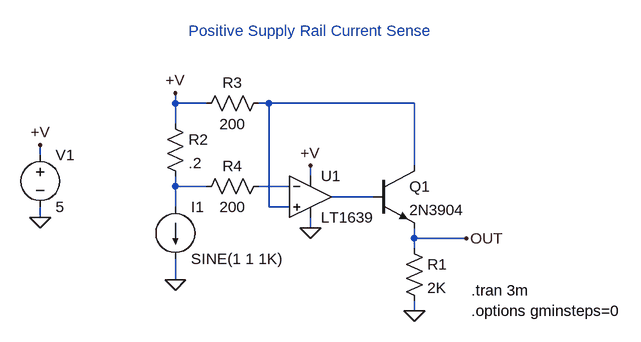
[diagram p0: schematic 1639.asc]
1639.asc, the LTspice schematic file:
Version 4
SHEET 1 896 680
WIRE -80 80 -80 64
WIRE -32 80 -80 80
WIRE 64 80 48 80
WIRE 288 80 64 80
WIRE -80 112 -80 80
WIRE -288 160 -288 144
WIRE 288 176 288 80
WIRE 128 192 128 176
WIRE -80 208 -80 192
WIRE -32 208 -80 208
WIRE 96 208 48 208
WIRE 224 224 160 224
WIRE -80 240 -80 208
WIRE 64 240 64 80
WIRE 96 240 64 240
WIRE -288 256 -288 240
WIRE 128 272 128 256
WIRE 288 288 288 272
WIRE 368 288 288 288
WIRE 288 304 288 288
WIRE -80 352 -80 320
WIRE 288 400 288 384
FLAG -288 256 0
FLAG 128 176 +V
FLAG -288 144 +V
FLAG 128 272 0
FLAG 288 400 0
FLAG -80 64 +V
FLAG -80 352 0
FLAG 368 288 OUT
SYMBOL voltage -288 144 R0
SYMATTR InstName V1
SYMATTR Value 5
SYMBOL npn 224 176 R0
SYMATTR InstName Q1
SYMATTR Value 2N3904
SYMBOL res 272 288 R0
SYMATTR InstName R1
SYMATTR Value 2K
SYMBOL res -96 96 R0
SYMATTR InstName R2
SYMATTR Value .2
SYMBOL res 64 64 R90
WINDOW 0 0 56 VBottom 2
WINDOW 3 32 56 VTop 2
SYMATTR InstName R3
SYMATTR Value 200
SYMBOL res 64 192 R90
WINDOW 0 0 56 VBottom 2
WINDOW 3 32 56 VTop 2
SYMATTR InstName R4
SYMATTR Value 200
SYMBOL current -80 240 R0
WINDOW 123 0 0 Left 2
WINDOW 39 0 0 Left 2
SYMATTR InstName I1
SYMATTR Value SINE(1 1 1K)
SYMBOL opamps\\LT1639 128 160 R0
SYMATTR InstName U1
TEXT 376 368 Left 2 !.tran 3m
TEXT 128 -16 Bottom 2 ;Positive Supply Rail Current Sense
TEXT 376 400 Left 2 !.options gminsteps=0

The netlist it stands for:
* 1639.asc
V1 +V 0 5
Q1 N001 N004 OUT 0 2N3904
R1 OUT 0 2K
R2 +V N002 .2
R3 N001 +V 200
R4 N003 N002 200
I1 N002 0 SINE(1 1 1K)
XU1 N001 N003 +V 0 N004 LT1639  ; pins In+ In- V+ V- OUT
.model NPN NPN
.model PNP PNP
.lib standard.bjt
.tran 3m
* Positive Supply Rail Current Sense
.options gminsteps=0
.backanno
.end